# EAGLE design HF0R0 (EAGLE 9.6.1)
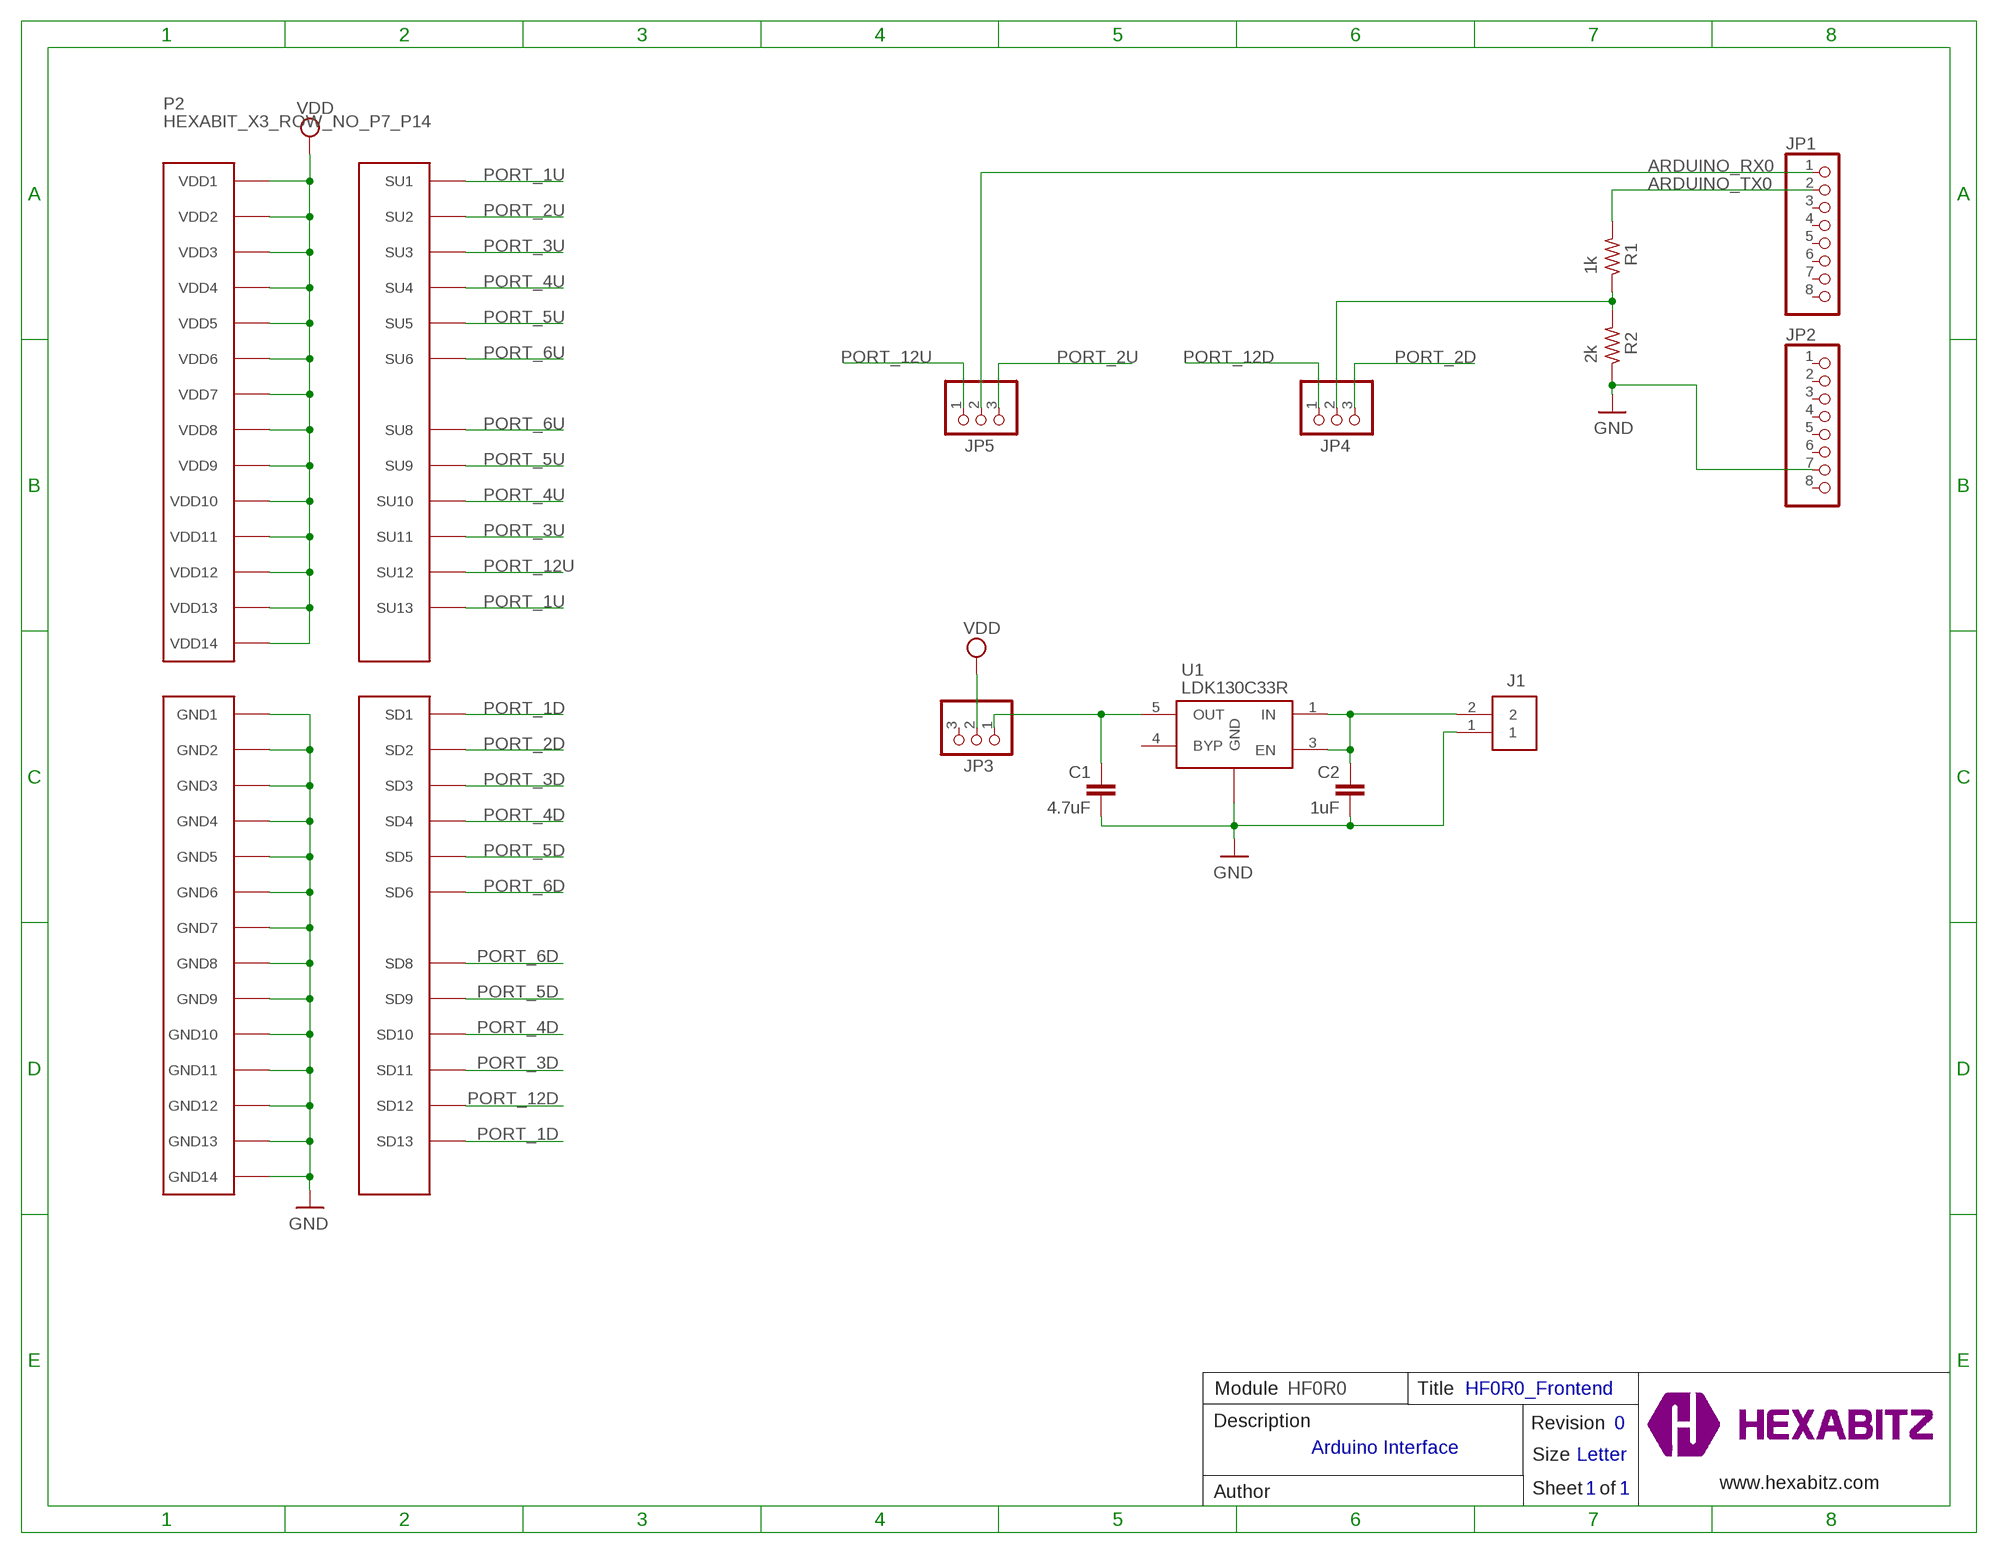
[diagram p0: schematic, sheet 1]

## Parts
C1  4.7uF  C-0805  [C-0805]
C2  1uF  C-0805  [C-0805]
J1  3-644456-2  [TE_3-644456-2]
JP1  PINHD-1X8  [1X08]
JP2  PINHD-1X8  [1X08]
JP3  PINHD-1X3  [1X03]
JP4  PINHD-1X3  [1X03]
JP5  PINHD-1X3  [1X03]
P2  HEXABIT_X3_ROW_NO_P7_P14  [HEXABIT_X3_ROW_NO_P7_P14]
R1  1k  R-0603  [R-0603]
R2  2k  R-0603  [R-0603]
U1  LDK130C33R  [SOT65P210X110-5N]
U$1  HEXABITZ-LOGO+SLOGAN  [HEXABITZ-LOGO+SLOGAN]

## Nets
ARDUINO_RX0: JP1.1 JP5.2
ARDUINO_TX0: JP1.2 R1.2
GND: C1.2 C2.2 J1.1 JP2.7 P2.PAD_PD15(GND1) P2.PAD_PD16(GND2) P2.PAD_PD17(GND3) P2.PAD_PD18(GND4) P2.PAD_PD19(GND5) P2.PAD_PD20(GND6) P2.PAD_PD21(GND7) P2.PAD_PD22(GND8) P2.PAD_PD23(GND9) P2.PAD_PD24(GND10) P2.PAD_PD25(GND11) P2.PAD_PD26(GND12) P2.PAD_PD27(GND13) P2.PAD_PD28(GND14) R2.1 U1.2(GND)
N$1: C1.1 JP3.1 U1.5(OUT)
N$2: JP4.2 R1.1 R2.2
N$4: C2.1 J1.2 U1.1(IN) U1.3(EN)
PORT_1D: P2.PAD_PD1(SD1) P2.PAD_PD13(SD13)
PORT_1U: P2.PAD_PU1(SU1) P2.PAD_PU13(SU13)
PORT_2D: JP4.3 P2.PAD_PD2(SD2)
PORT_2U: JP5.3 P2.PAD_PU2(SU2)
PORT_3D: P2.PAD_PD3(SD3) P2.PAD_PD11(SD11)
PORT_3U: P2.PAD_PU3(SU3) P2.PAD_PU11(SU11)
PORT_4D: P2.PAD_PD4(SD4) P2.PAD_PD10(SD10)
PORT_4U: P2.PAD_PU4(SU4) P2.PAD_PU10(SU10)
PORT_5D: P2.PAD_PD5(SD5) P2.PAD_PD9(SD9)
PORT_5U: P2.PAD_PU5(SU5) P2.PAD_PU9(SU9)
PORT_6D: P2.PAD_PD6(SD6) P2.PAD_PD8(SD8)
PORT_6U: P2.PAD_PU6(SU6) P2.PAD_PU8(SU8)
PORT_12D: JP4.1 P2.PAD_PD12(SD12)
PORT_12U: JP5.1 P2.PAD_PU12(SU12)
VDD: JP3.2 P2.PAD_PU15(VDD1) P2.PAD_PU16(VDD2) P2.PAD_PU17(VDD3) P2.PAD_PU18(VDD4) P2.PAD_PU19(VDD5) P2.PAD_PU20(VDD6) P2.PAD_PU21(VDD7) P2.PAD_PU22(VDD8) P2.PAD_PU23(VDD9) P2.PAD_PU24(VDD10) P2.PAD_PU25(VDD11) P2.PAD_PU26(VDD12) P2.PAD_PU27(VDD13) P2.PAD_PU28(VDD14)
Unconnected: JP1.3 JP1.4 JP1.5 JP1.6 JP1.7 JP1.8 JP2.1 JP2.2 JP2.3 JP2.4 JP2.5 JP2.6 JP2.8 JP3.3 U1.4(BYP)

## Notes on the sheet
- Module | HF0R0 | Title | HF0R0_Frontend
- Description | Revision | 0
- Arduino Interface
- Size | Letter
- www.hexabitz.com
- Author | Sheet   of | 1 | 1
- C:/Users/Moazzen/Pictures/Presentation1.bmp
- C:/Users/Moazzen/Pictures/Presentation1.bmp | C:/Users/Moazzen/Pictures/Presentation1.bmp
- C:/Users/Moazzen/Pictures/Presentation1.bmp

## Library data of the parts
C1 C2 = HEXABITZ_RCLS:C-0805: CAP CER 10% X7R 0805
J1 = HEXABITZ_USER_INTERFACE_PARTS:3-644456-2; AVAILABILITY: Unavailable; CENTERLINE_PITCH: 2.54 mm[.1 in]; COMMENT: 3-644456-2; DESCRIPTION: Connector Unshrouded Header HDR 2 Position 2.54mm Solder Straight Thru-Hole; EU_ROHS_COMPLIANCE: Compliant; MF: TE Connectivity; MFN: TE Connectivity; MP: 3-644456-2; MPN: 87224-1; NUMBER_OF_POSITIONS: 2; OCTOPART_URL: https://octopart.com/87224-1-te+connectivity-39512011?r=sp; PACKAGE: None; PRICE: None; PRODUCT_TYPE: Connector; TE_PURCHASE_URL: https://www.te.com/usa-en/product-3-644456-2.html?te_bu=Cor&te_type=disp&te_campaign=seda_glo_cor-seda-global-disp-prtnr-fy19-seda-model-bom-cta_sma-317_1&elqCampaignId=32493
JP1 JP2 = pinhead:PINHD-1X8: PIN HEADER
JP3-JP5 = HEXABITZ_CONNECTION_PARTS:PINHD-1X3: PIN HEADER
P2 = hexabitz_connectors:HEXABIT_X3_ROW_NO_P7_P14: Hexabitz Double Hexagon Module Connector Hexagon side length = 17.32mm. The following ports are removed: P5, P10, P11, P12
R1 R2 = HEXABITZ_RCLS:R-0603: Thick Film Resistors - SMD 0603
U1 = HEXABITZ_ICs:LDK130C33R: LDO Regulator Pos 3.3V 0.3A 5-Pin SOT-323 T/R Source: Datasheet <http://www.st.com/content/ccc/resource/technical/document/datasheet/29/10/f7/87/2f/66/47/f4/DM00076097.pdf/files/DM00076097.pdf/jcr:content/translations/en.DM00076097.pdf>; DESCRIPTION: LDO Regulator Pos 3.3V 0.3A 5-Pin SOT-323 T/R; HEIGHT: 1.1mm; MANUFACTURER_NAME: STMicroelectronics; MANUFACTURER_PART_NUMBER: LDK130C33R; MOUSER_PART_NUMBER: 511-LDK130C33R; MOUSER_PRICE-STOCK: https://www.mouser.co.uk/ProductDetail/STMicroelectronics/LDK130C33R?qs=WHlX%252B%252B9%2FRwCENF1z4ap3Hg%3D%3D
U$1 = HEXABITZ_USER_INTERFACE_PARTS:HEXABITZ-LOGO+SLOGAN

## Board
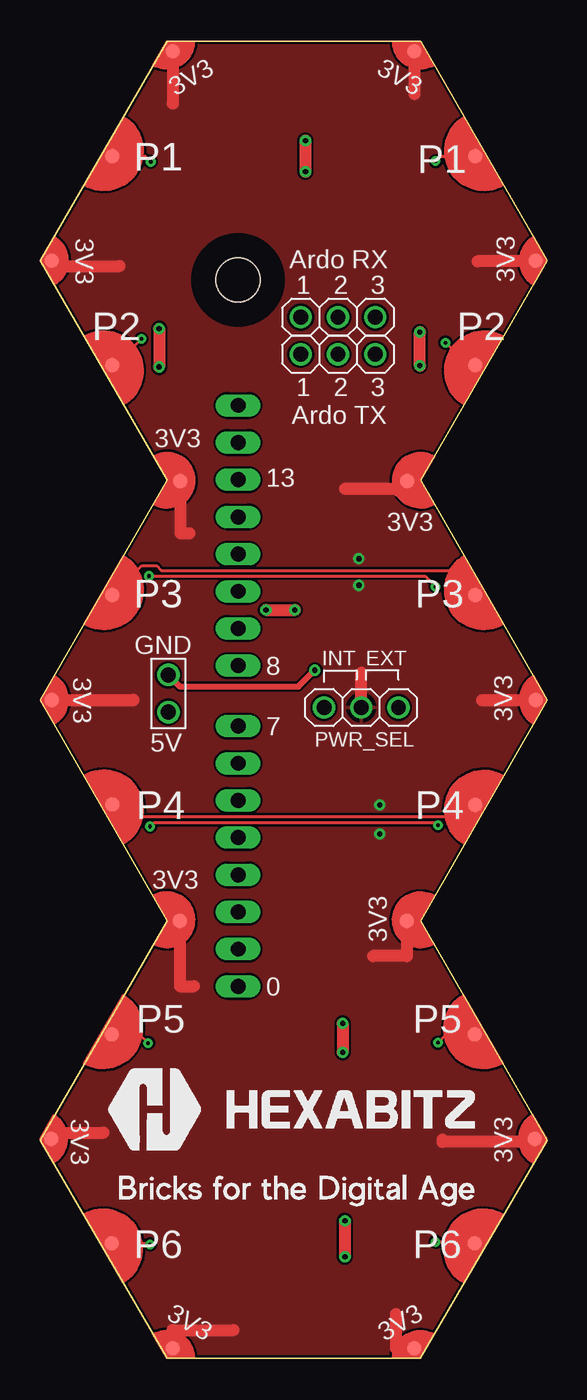
[diagram p1: board, top side]
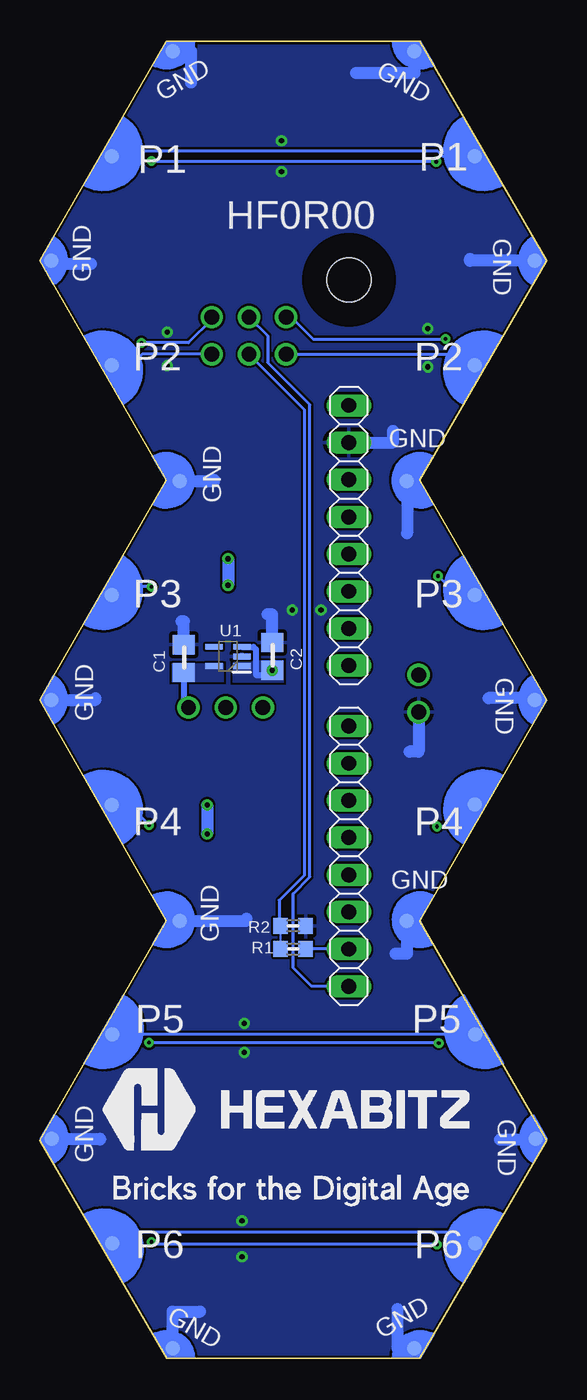
[diagram p2: board, bottom side, seen from below]

Size 34.64 x 89.99 mm. Coordinates in mm from the lower left corner, seen from the top.
Copper layers (1*16): Top 0.035mm / dielectric 1.5mm / Bottom 0.035mm
Design rules "2_layer *": minimum track width 6mil, minimum drill 0.25mm, track to track 6mil, track to pad 6mil, pad to pad 6mil, via to via 6mil, smd to smd 0mil, copper to edge 0.15mm, drill to drill 8mil, minimum pad ring 10mil, minimum via ring 8mil, stop-mask expansion 2mil, vias tented up to drill 15mil, thermal gap 10mil
Holes 3 mm at 13.51,73.68
tRestrict: area 10.4,70.5 to 16.7,76.8
bRestrict: area 10.4,70.5 to 16.7,76.8

### Footprints (pad centres in the part's own frame; a part is rotated, then mirrored left to right if it is on the bottom)
C-0805 = smd 1.3 x 1.5: 1 -0.95,0; 2 0.95,0
TE_3-644456-2 = drill 1.02 pad 1.37: 1 0,0; 2 2.54,0
1X08 = drill 1.016 long: 1 -8.89,0; 2 -6.35,0; 3 -3.81,0; 4 -1.27,0; 5 1.27,0; 6 3.81,0; 7 6.35,0; 8 8.89,0
1X03 = drill 1.016: 1 -2.54,0; 2 0,0; 3 2.54,0
HEXABIT_X3_ROW_NO_P7_P14 = smd 1 x 1 bottom: PAD_PD1 12.39,37.198; PAD_PD2 12.39,22.898; PAD_PD3 12.39,7.198; PAD_PD4 12.39,-7.125; PAD_PD5 12.339,-22.797; PAD_PD6 12.339,-37.097; PAD_PD8 -12.441,-37.097; PAD_PD9 -12.441,-22.797; PAD_PD10 -12.39,-7.099; PAD_PD11 -12.39,7.198; PAD_PD12 -12.39,22.898; PAD_PD13 -12.39,37.198; PAD_PD15 8.235,44.361; PAD_PD16 16.52,30.048; PAD_PD17 7.752,14.976; PAD_PD18 16.52,0.048; PAD_PD19 7.727,-15.047; PAD_PD20 16.469,-29.947; PAD_PD21 8.235,-44.259; PAD_PD22 -8.285,-44.259; PAD_PD23 -16.571,-29.947; PAD_PD24 -7.777,-15.047; PAD_PD25 -16.52,0.048; PAD_PD26 -7.752,14.976; PAD_PD27 -16.52,30.048; PAD_PD28 -8.285,44.361 | smd 1 x 1: PAD_PU1 12.39,37.198; PAD_PU2 12.39,22.898; PAD_PU3 12.39,7.198; PAD_PU4 12.39,-7.125; PAD_PU5 12.339,-22.797; PAD_PU6 12.339,-37.097; PAD_PU8 -12.441,-37.097; PAD_PU9 -12.441,-22.797; PAD_PU10 -12.39,-7.099; PAD_PU11 -12.39,7.198; PAD_PU12 -12.39,22.898; PAD_PU13 -12.39,37.198; PAD_PU15 8.235,44.361; PAD_PU16 16.52,30.048; PAD_PU17 7.752,14.976; PAD_PU18 16.52,0.048; PAD_PU19 7.727,-15.047; PAD_PU20 16.469,-29.947; PAD_PU21 8.235,-44.259; PAD_PU22 -8.285,-44.259; PAD_PU23 -16.571,-29.947; PAD_PU24 -7.777,-15.047; PAD_PU25 -16.52,0.048; PAD_PU26 -7.752,14.976; PAD_PU27 -16.52,30.048; PAD_PU28 -8.285,44.361
R-0603 = smd 1 x 1.1: 1 -0.85,0; 2 0.85,0
SOT65P210X110-5N = smd 1.2 x 0.4: 1 -0.95,0.65; 2 -0.95,0; 3 -0.95,-0.65; 4 0.95,-0.65; 5 0.95,0.65

### Placement (x,y rotation side)
C1  24.78,47.8 90 bottom
C2  18.75,47.96 90 bottom
J1  8.75,44.15 90 top
JP1  13.51,34.31 90 bottom
JP2  13.51,56.22 90 bottom
JP3  21.92,44.47 180 top
JP4  20.34,68.6 0 top
JP5  20.34,71.14 0 top
P2  17.32,44.95 0 top
R1  17.32,27.96 0 bottom
R2  17.32,29.55 180 bottom
U1  21.77,47.96 180 bottom
U$1  16.84,13.2 0 top

### Tracks (layer width: path | path; a pad name or v marks a point on that pad's centre or on a via)
ARDUINO_RX0
  Bottom 0.203: JP1.1 16.05,25.42 17.32,26.69 17.32,31.74 16.17,32.89 16.17,65.15 19.07,68.04 19.07,69.87 JP5.2
ARDUINO_TX0
  Bottom 0.203: JP1.2 R1.2
GND  (via drill 0.35 pad 0.75)
  Top 0.813: v20.65,22.88 v20.65,20.91 | v20.81,9.39 v20.81,6.94 | v18.11,83.2 v18.11,81.07 | v8.11,70.35 v8.11,67.74 | v25.93,67.83 v25.93,70.12 | v15.42,51.14 v17.39,51.14
  Bottom 0.813: 30.81,45.11 30.81,44.99 P2.PAD_PD18 | P2.PAD_PD19 20.5,29.9 20.5,30.02 | P2.PAD_PD20 30.5,15 30.5,14.94 | P2.PAD_PD23 0.75,14.94 3.19,14.94 | P2.PAD_PD22 10.18,0.69 10.18,3.35 | P2.PAD_PD21 25.55,3.19 23.67,3.19 | P2.PAD_PD15 24.31,89.31 24.31,87.17 | P2.PAD_PD28 9.03,87.81 13.03,87.81 | P2.PAD_PD27 5.26,74.99 5.26,75.11 | P2.PAD_PD16 33.64,74.79 31.13,74.79 | P2.PAD_PD17 22.72,59.92 22.72,60.03 | P2.PAD_PD26 9.54,59.92 9.54,56.38 | P2.PAD_PD25 0.8,45.11 3.99,45.11 | P2.PAD_PD24 9.54,27.64 10.34,27.64 | J1.1 8.75,41.45 9.38,41.45 | JP2.7 10.49,62.57 10.49,63.36 | C2.2 18.75,50.82 19.07,50.82 | C1.2 24.78,50.34 24.94,50.34
  pour Bottom (rank 2): -0.14,90.03 34.62,90.03 34.62,0.02 -0.14,0.02
N$1
  Bottom 0.406: C1.1 24.78,44.79 JP3.1
  pour Bottom (no thermals): 22.08,47.49 22.08,46.22 25.57,46.22 25.57,47.49
N$2
  Bottom 0.152: R1.1 R2.2
  Bottom 0.203: R2.2 18.27,29.65 18.27,31.29 16.53,33.04 16.53,64.79 JP4.2
N$4  (via drill 0.35 pad 0.75)
  Top 0.406: J1.2 9.54,45.9 17.64,45.9 C2.1
  Bottom 0.406: U1.3 20.03,48.61 19.86,48.44 19.86,47.62 19.86,47.61 19.86,46.69 19.07,46.69 C2.1
  other vias: 18.75,47.01
  pour Bottom (no thermals): 21.45,47.49 21.45,46.22 17.95,46.22 17.95,47.65 21.29,47.65
PORT_1D
  Bottom 0.203: P2.PAD_PD1 27.8,82.14 27.44,82.5 7.46,82.5 7.1,82.14 P2.PAD_PD13
PORT_1U  (via drill 0.25 pad 0.55)
  Top 0.203: P2.PAD_PU13 7.16,82.14 v7.54,81.76 | v27,81.8 27.34,82.14 P2.PAD_PU1
  Bottom 0.203: v27,81.8 26.74,81.8 26.71,81.78 7.56,81.78 v7.54,81.76
PORT_2D
  Bottom 0.203: JP4.3 27.64,68.6 28.39,67.84 P2.PAD_PD2
PORT_2U  (via drill 0.25 pad 0.55)
  Top 0.203: v27.68,69.38 29.22,67.84 P2.PAD_PU2
  Bottom 0.203: JP5.3 22.88,70.98 24.47,69.38 v27.68,69.38
PORT_3D  (via drill 0.25 pad 0.55)
  Top 0.203: v7.42,53.45 26.28,53.45 v27,52.72
  Bottom 0.203: P2.PAD_PD11 6.12,52.14 v7.42,53.45 | v27,52.72 29.13,52.72 P2.PAD_PD3
PORT_3U
  Top 0.203: P2.PAD_PU11 6.94,54.15 7.95,54.15 8.27,53.84 28.02,53.84 P2.PAD_PU3
PORT_4D  (via drill 0.25 pad 0.55)
  Top 0.203: v7.5,36.34 7.75,36.6 26.99,36.6 v27.16,36.43
  Bottom 0.203: P2.PAD_PD10 6.43,36.34 v7.5,36.34 | v27.16,36.43 28.56,37.82 P2.PAD_PD4
PORT_4U
  Top 0.203: P2.PAD_PU10 5.77,37.01 28.9,37.01 P2.PAD_PU4
PORT_5D
  Bottom 0.203: P2.PAD_PD9 P2.PAD_PD5
PORT_5U  (via drill 0.25 pad 0.55)
  Top 0.203: P2.PAD_PU9 6.77,22.15 v7.37,21.55 | v27.16,21.57 27.74,22.15 P2.PAD_PU5
  Bottom 0.203: v7.37,21.55 27.14,21.55 v27.16,21.57
PORT_6D
  Bottom 0.203: P2.PAD_PD6 28.87,8.64 5.67,8.64 P2.PAD_PD8
PORT_6U  (via drill 0.25 pad 0.55)
  Top 0.203: P2.PAD_PU8 7.44,7.85 v7.5,7.78 | v27,7.96 29.55,7.96 P2.PAD_PU6
  Bottom 0.203: v7.5,7.78 26.83,7.78 v27,7.96
PORT_12D
  Bottom 0.203: JP4.1 6.68,68.6 5.93,67.84 P2.PAD_PD12
PORT_12U  (via drill 0.25 pad 0.55)
  Top 0.203: v6.91,69.65 5.11,67.84 P2.PAD_PU12
  Bottom 0.203: JP5.1 17.45,71.14 15.96,69.65 v6.91,69.65
VDD  (via drill 0.35 pad 0.75)
  Top 0.813: P2.PAD_PU28 9.03,85.75 9.07,85.75 | P2.PAD_PU15 25.55,86.38 25.58,86.38 | P2.PAD_PU16 33.84,74.95 29.86,74.95 | P2.PAD_PU27 1.16,74.63 5.41,74.63 | P2.PAD_PU26 9.57,56.38 10.18,56.38 | P2.PAD_PU17 24.44,59.29 24.44,59.39 20.81,59.39 | P2.PAD_PU18 33.84,44.95 30.18,44.95 | P2.PAD_PU25 6.37,44.99 6.37,44.95 | P2.PAD_PU24 9.54,25.42 10.49,25.42 | P2.PAD_PU19 25.05,27.48 22.72,27.48 | P2.PAD_PU23 0.75,15.42 4.3,15.42 | P2.PAD_PU20 33.79,14.78 27.48,14.78 27.48,14.94 | P2.PAD_PU21 24.31,0.69 24.31,3.04 | P2.PAD_PU22 9.03,1.92 13.19,1.92 | JP3.2 21.92,46.85
  Bottom 0.813: v21.77,54.63 v21.77,52.82 | v23.19,37.8 v23.19,35.83
  pour Top: -0.14,90.03 34.62,90.03 34.62,0.02 -0.14,0.02

### Text on the board
tPlace: 3V3 | 3V3 | P1 | P1 | 3V3 | Ardo RX | 3V3 | 1 | 2 | 3 | P2 | P2 | 1 | 2 | 3 | Ardo TX | 3V3 | 13 | 3V3 | P3 | P3 | GND | INT | EXT | 3V3 | 8 | 3V3 | 5V | 7 | PWR_SEL | P4 | P4 | 3V3 | 3V3 | 0 | P5 | P5 | 3V3 | 3V3 | P6 | P6 | 3V3 | 3V3
bPlace: GND | GND | P1 | P1 | HF0R00 | GND | GND | P2 | P2 | GND | GND | P3 | P3 | GND | GND | P4 | P4 | GND | GND | P5 | P5 | GND | GND | P6 | P6 | GND | GND